# Altium schematic sheet 0101_STORAGE - M.SchDoc
size A3
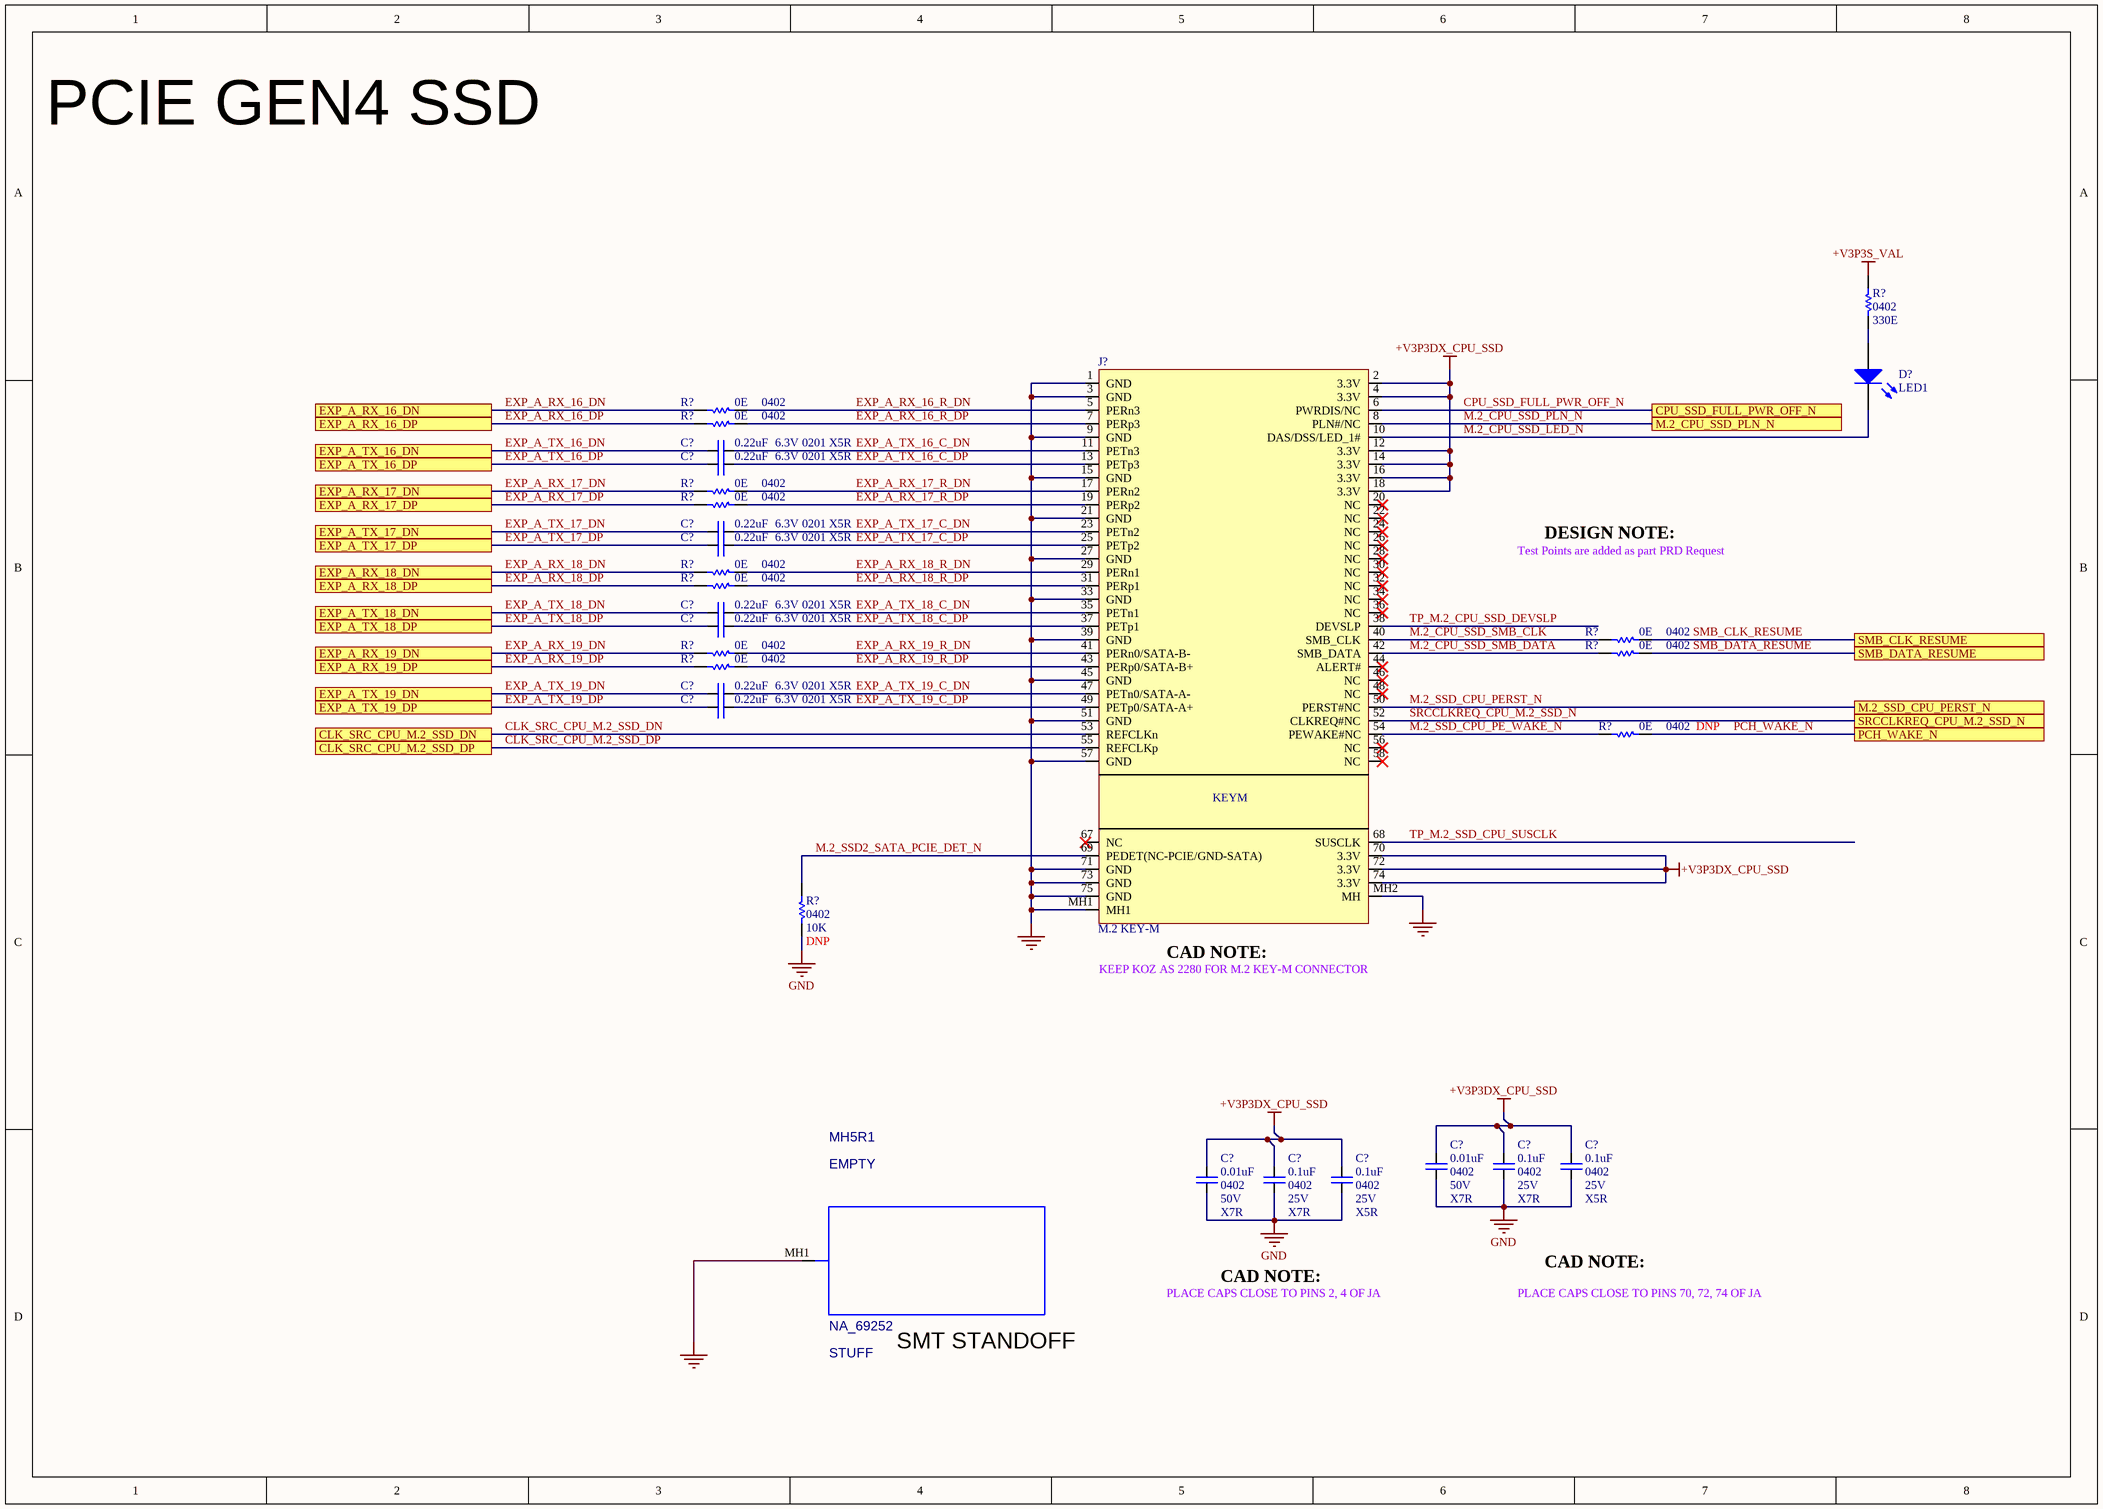
[diagram p0: 0101_STORAGE - M.SchDoc]

## Parts
(Parts that share a designator on the sheet are numbered #1, #2 ... from top to bottom, then left to right.)
C?#1  value 0.22uF  Case/Package: 0201  Voltage: 6.3V  Dielectric: X5R  [CAPC0201]
C?#2  value 0.22uF  Case/Package: 0201  Voltage: 6.3V  Dielectric: X5R  [CAPC0201]
C?#3  value 0.22uF  Case/Package: 0201  Voltage: 6.3V  Dielectric: X5R  [CAPC0201]
C?#4  value 0.22uF  Case/Package: 0201  Voltage: 6.3V  Dielectric: X5R  [CAPC0201]
C?#5  value 0.22uF  Case/Package: 0201  Voltage: 6.3V  Dielectric: X5R  [CAPC0201]
C?#6  value 0.22uF  Case/Package: 0201  Voltage: 6.3V  Dielectric: X5R  [CAPC0201]
C?#7  value 0.22uF  Case/Package: 0201  Voltage: 6.3V  Dielectric: X5R  [CAPC0201]
C?#8  value 0.22uF  Case/Package: 0201  Voltage: 6.3V  Dielectric: X5R  [CAPC0201]
C?#9  value 0.01uF  Case/Package: 0402  Voltage: 50V  Dielectric: X7R  [CAPC0402]
C?#10  value 0.1uF  Case/Package: 0402  Voltage: 25V  Dielectric: X7R  [CAPC0201]
C?#11  value 0.1uF  Case/Package: 0402  Voltage: 25V  Dielectric: X5R  [CAPC0805]
C?#12  value 0.01uF  Case/Package: 0402  Voltage: 50V  Dielectric: X7R  [CAPC0402]
C?#13  value 0.1uF  Case/Package: 0402  Voltage: 25V  Dielectric: X7R  [CAPC0201]
C?#14  value 0.1uF  Case/Package: 0402  Voltage: 25V  Dielectric: X5R  [CAPC0805]
D?  LED1  [LED_0603]
J?  M.2 KEY-M
MH5R1  BOM_USE: STUFF  MATERIAL: EMPTY  PART_NUMBER: NA_69252  [MTG_5000P3500_MA]  (hidden comment: MTG_HOLE_2)
R?#1  value 330E  Case/Package: 0402  [RESC0402]  (hidden comment: Res)
R?#2  value 0E  Case/Package: 0402  [RESC0402]  (hidden comment: Res)
R?#3  value 0E  Case/Package: 0402  [RESC0402]  (hidden comment: Res)
R?#4  value 0E  Case/Package: 0402  [RESC0402]  (hidden comment: Res)
R?#5  value 0E  Case/Package: 0402  [RESC0402]  (hidden comment: Res)
R?#6  value 0E  Case/Package: 0402  [RESC0402]  (hidden comment: Res)
R?#7  value 0E  Case/Package: 0402  [RESC0402]  (hidden comment: Res)
R?#8  value 0E  Case/Package: 0402  [RESC0402]  (hidden comment: Res)
R?#9  value 0E  Case/Package: 0402  [RESC0402]  (hidden comment: Res)
R?#10  value 0E  Case/Package: 0402  [RESC0402]  (hidden comment: Res)
R?#11  value 0E  Case/Package: 0402  [RESC0402]  (hidden comment: Res)
R?#12  value 0E  Case/Package: 0402  [RESC0402]  (hidden comment: Res)
R?#13  value 10K  Case/Package: 0402  [RESC0402]  (hidden comment: Res)

## Ports
CLK_SRC_CPU_M.2_SSD_DN, CLK_SRC_CPU_M.2_SSD_DP, CPU_SSD_FULL_PWR_OFF_N, EXP_A_RX_16_DN, EXP_A_RX_16_DP, EXP_A_RX_17_DN, EXP_A_RX_17_DP, EXP_A_RX_18_DN, EXP_A_RX_18_DP, EXP_A_RX_19_DN, EXP_A_RX_19_DP, EXP_A_TX_16_DN, EXP_A_TX_16_DP, EXP_A_TX_17_DN, EXP_A_TX_17_DP, EXP_A_TX_18_DN, EXP_A_TX_18_DP, EXP_A_TX_19_DN, EXP_A_TX_19_DP, M.2_CPU_SSD_PLN_N, M.2_SSD_CPU_PERST_N, PCH_WAKE_N, SMB_CLK_RESUME, SMB_DATA_RESUME, SRCCLKREQ_CPU_M.2_SSD_N

## Nets
+V3P3DX_CPU_SSD: C?#9.1 C?#10.1 C?#11.1 C?#12.1 C?#13.1 C?#14.1 J?.2(3.3V) J?.4(3.3V) J?.12(3.3V) J?.14(3.3V) J?.16(3.3V) J?.18(3.3V) J?.70(3.3V) J?.72(3.3V) J?.74(3.3V)
+V3P3S_VAL: R?#1.2
GND: C?#9.2 C?#10.2 C?#11.2 C?#12.2 C?#13.2 C?#14.2 J?.1(GND) J?.3(GND) J?.9(GND) J?.15(GND) J?.21(GND) J?.27(GND) J?.33(GND) J?.39(GND) J?.45(GND) J?.51(GND) J?.57(GND) J?.71(GND) J?.73(GND) J?.75(GND) J?.MH1 J?.MH2(MH) MH5R1.MH1 R?#13.1
CLK_SRC_CPU_M.2_SSD_DN: J?.53(REFCLKn) ; port CLK_SRC_CPU_M.2_SSD_DN
CLK_SRC_CPU_M.2_SSD_DP: J?.55(REFCLKp) ; port CLK_SRC_CPU_M.2_SSD_DP
CPU_SSD_FULL_PWR_OFF_N: J?.6(PWRDIS/NC) ; port CPU_SSD_FULL_PWR_OFF_N
EXP_A_RX_16_DN: R?#2.1 ; port EXP_A_RX_16_DN
EXP_A_RX_16_DP: R?#3.1 ; port EXP_A_RX_16_DP
EXP_A_RX_16_R_DN: J?.5(PERn3) R?#2.2
EXP_A_RX_16_R_DP: J?.7(PERp3) R?#3.2
EXP_A_RX_17_DN: R?#4.1 ; port EXP_A_RX_17_DN
EXP_A_RX_17_DP: R?#5.1 ; port EXP_A_RX_17_DP
EXP_A_RX_17_R_DN: J?.17(PERn2) R?#4.2
EXP_A_RX_17_R_DP: J?.19(PERp2) R?#5.2
EXP_A_RX_18_DN: R?#6.1 ; port EXP_A_RX_18_DN
EXP_A_RX_18_DP: R?#7.1 ; port EXP_A_RX_18_DP
EXP_A_RX_18_R_DN: J?.29(PERn1) R?#6.2
EXP_A_RX_18_R_DP: J?.31(PERp1) R?#7.2
EXP_A_RX_19_DN: R?#9.1 ; port EXP_A_RX_19_DN
EXP_A_RX_19_DP: R?#11.1 ; port EXP_A_RX_19_DP
EXP_A_RX_19_R_DN: J?.41(PERn0/SATA-B-) R?#9.2
EXP_A_RX_19_R_DP: J?.43(PERp0/SATA-B+) R?#11.2
EXP_A_TX_16_C_DN: C?#1.2 J?.11(PETn3)
EXP_A_TX_16_C_DP: C?#2.2 J?.13(PETp3)
EXP_A_TX_16_DN: C?#1.1 ; port EXP_A_TX_16_DN
EXP_A_TX_16_DP: C?#2.1 ; port EXP_A_TX_16_DP
EXP_A_TX_17_C_DN: C?#3.2 J?.23(PETn2)
EXP_A_TX_17_C_DP: C?#4.2 J?.25(PETp2)
EXP_A_TX_17_DN: C?#3.1 ; port EXP_A_TX_17_DN
EXP_A_TX_17_DP: C?#4.1 ; port EXP_A_TX_17_DP
EXP_A_TX_18_C_DN: C?#5.2 J?.35(PETn1)
EXP_A_TX_18_C_DP: C?#6.2 J?.37(PETp1)
EXP_A_TX_18_DN: C?#5.1 ; port EXP_A_TX_18_DN
EXP_A_TX_18_DP: C?#6.1 ; port EXP_A_TX_18_DP
EXP_A_TX_19_C_DN: C?#7.2 J?.47(PETn0/SATA-A-)
EXP_A_TX_19_C_DP: C?#8.2 J?.49(PETp0/SATA-A+)
EXP_A_TX_19_DN: C?#7.1 ; port EXP_A_TX_19_DN
EXP_A_TX_19_DP: C?#8.1 ; port EXP_A_TX_19_DP
M.2_CPU_SSD_LED_N: D?.K J?.10(DAS/DSS/LED_1#)
M.2_CPU_SSD_PLN_N: J?.8(PLN#/NC) ; port M.2_CPU_SSD_PLN_N
M.2_CPU_SSD_SMB_CLK: J?.40(SMB_CLK) R?#8.1
M.2_CPU_SSD_SMB_DATA: J?.42(SMB_DATA) R?#10.1
M.2_SSD2_SATA_PCIE_DET_N: J?.69(PEDET(NC-PCIE/GND-SATA)) R?#13.2
M.2_SSD_CPU_PE_WAKE_N: J?.54(PEWAKE#NC) R?#12.1
M.2_SSD_CPU_PERST_N: J?.50(PERST#NC) ; port M.2_SSD_CPU_PERST_N
PCH_WAKE_N: R?#12.2 ; port PCH_WAKE_N
SMB_CLK_RESUME: R?#8.2 ; port SMB_CLK_RESUME
SMB_DATA_RESUME: R?#10.2 ; port SMB_DATA_RESUME
SRCCLKREQ_CPU_M.2_SSD_N: J?.52(CLKREQ#NC) ; port SRCCLKREQ_CPU_M.2_SSD_N
TP_M.2_CPU_SSD_DEVSLP: J?.38(DEVSLP)
TP_M.2_SSD_CPU_SUSCLK: J?.68(SUSCLK)
NetD?_A: D?.A R?#1.1

Not connected (* = marked no-connect by the designer): J? 20(NC)* 22(NC)* 24(NC)* 26(NC)* 28(NC)* 30(NC)* 32(NC)* 34(NC)* 36(NC)* 44(ALERT#)* 46(NC)* 48(NC)* 56(NC)* 58(NC)* 67(NC)*

## Notes on the sheet
- PCIE GEN4 SSD
- Test Points are added as part PRD Request
- DESIGN NOTE:
- KEEP KOZ AS 2280 FOR M.2 KEY-M CONNECTOR
- (near J?) CAD NOTE:
- PLACE CAPS CLOSE TO PINS 2, 4 OF JA
- CAD NOTE:
- PLACE CAPS CLOSE TO PINS 70, 72, 74 OF JA
- SMT STANDOFF
- (in symbol M.2 KEY-M) KEYM

## Library data of the parts
C?#1-C?#8 = Cap: CAP CER 0.22uF 6.3V X5R 0201
C?#9 C?#12 = Cap: CAP CER 0.01uF 50V X7R 0402
C?#10 C?#13 = Cap: CAP CER 0.1uF 25V X7R 0402
C?#11 C?#14 = Cap: CAP CER 22uF 25V X5R 0805
D? = LED1: Typical RED GaAs LED; Manufacturer Part Number: LED; Case/Package: 0603
MH5R1 = MTG_HOLE_2: CDS_PHYS_PART_NAME: MTG_HOLE_2_TH-NA_69252,EMPTY,MTG_HOLE,TK0,GENERIC; CDS_LMAN_SYM_OUTLINE: -200,100,200,-100; FP_TECH: TK0; IP: GENERIC; PACK_TYPE: TH; ROOM: NONE; OriginalSymbolOrigin: (-225,100); XY: (-525,2300); VER: 1; ROT: 0; PHYS_PAGE: 101; LOCATION: MH5R1; DRAWING: @RVP1_ADL_SB_ADP_S_DDR5_SODIMM_2DPC_LIB.H55_DG2_2DPC(SCH_1):PAGE472; CDS_LIB: local; VARIANT: ?; PCB Footprint: MTG_5000P3500_MA; CHIPS_PART_NAME: MTG_HOLE_2; CDS_PART_NAME: MTG_HOLE_2_TH-NA_69252,EMPTY,MTG_HOLE,TK0,GENERIC; CDS_LOCATION: MH5R1
R?#1 = Res: Thick Film Resistor -  330ohm, 1%, 0402
R?#2-R?#12 = Res: Thick Film Resistor -  0ohm, 1%, 0402
  R?#12: DNP: DNP
R?#13 = Res: Thick Film Resistor -  10Kohm, 1%, 0402; DNP: DNP